# EAGLE design DRV8876_Breakout (EAGLE 9.4.2)
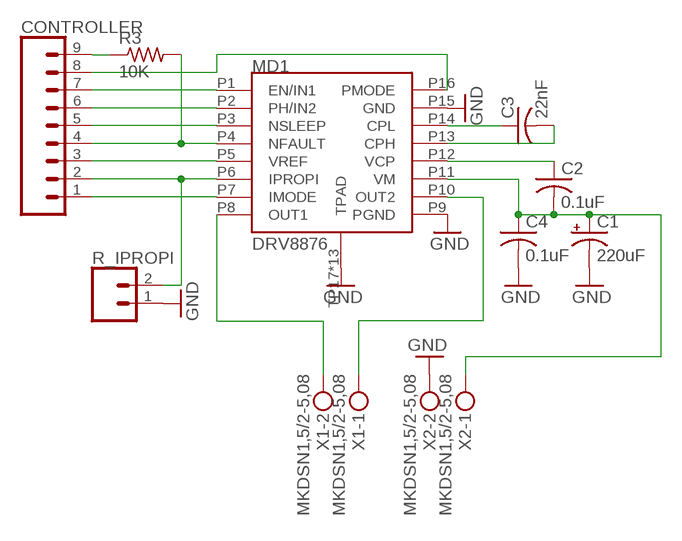
[diagram p0: schematic, sheet 1]

## Parts
C1  220uF  CPOL-USE3.5-8  [E3,5-8]
C2  0.1uF  C-USC0805  [C0805]
C3  22nF  C-USC0805  [C0805]
C4  0.1uF  C-USC0805  [C0805]
CONTROLLER  CONN_09NO_SILK  [1X09_NO_SILK]
MD1  DRV8876  [DRV8876]
R3  10K  R-US_R0805  [R0805]
R_IPROPI  CONN_021X02_NO_SILK  [1X02_NO_SILK]
X1  MKDSN1,5/2-5,08  [MKDSN1,5/2-5,08]
X2  MKDSN1,5/2-5,08  [MKDSN1,5/2-5,08]

## Nets
CLP: C3.1 MD1.P14(CPL)
CPH: C3.2 MD1.P13(CPH)
EN/IN1: CONTROLLER.7 MD1.P1(EN/IN1)
GND: C1.- C4.2 MD1.P9(PGND) MD1.P15(GND) MD1.TP17(TPAD) MD1.TV18(TPAD) MD1.TV19(TPAD) MD1.TV20(TPAD) MD1.TV21(TPAD) MD1.TV22(TPAD) MD1.TV23(TPAD) MD1.TV24(TPAD) MD1.TV25(TPAD) MD1.TV26(TPAD) MD1.TV27(TPAD) MD1.TV28(TPAD) MD1.TV29(TPAD) R_IPROPI.1 X2.2
IMODE: CONTROLLER.1 MD1.P7(IMODE)
IPROPI: CONTROLLER.2 MD1.P6(IPROPI) R_IPROPI.2
NFAULT: CONTROLLER.4 MD1.P4(NFAULT) R3.2
NSLEEP: CONTROLLER.5 MD1.P3(NSLEEP)
OUT1: MD1.P8(OUT1) X1.2
OUT2: MD1.P10(OUT2) X1.1
PH/IN2: CONTROLLER.6 MD1.P2(PH/IN2)
PMODE: CONTROLLER.8 MD1.P16(PMODE)
VCC: CONTROLLER.9 R3.1
VCP: C2.1 MD1.P12(VCP)
VM: C1.+ C2.2 C4.1 MD1.P11(VM) X2.1
VREF: CONTROLLER.3 MD1.P5(VREF)

## Library data of the parts
C1 = rcl:CPOL-US: POLARIZED CAPACITOR, American symbol; SPICEPREFIX: C
C2-C4 = rcl:C-US: CAPACITOR, American symbol; SPICEPREFIX: C
CONTROLLER = SparkFun-Connectors:CONN_09: Multi connection point. Often used as Generic Header-pin footprint for 0.1 inch spaced/style header connections On any of the 0.1 inch spaced packages, you can populate with these: Break Away Headers - Straight <https://www.sparkfun.com/products/116> (PRT-00116) Break Away Male Headers - Right Angle <https://www.sparkfun.com/products/553> (PRT-00553) Female Headers <https://www.sparkfun.com/products/115> (PRT-00115) Break Away Headers - Machine Pin <https://www.sparkfun.com/products/117> (PRT-00117) Break Away Female Headers - Swiss Machine Pin <https://www.sparkfun.com/products/743> (PRT-00743) For SCREWTERMINALS and SPRING TERMINALS visit here: Screw Terimnals on SparkFun.com <https://www.sparkfun.com/search/results?term=Screw+Terminals> (5mm/3.5mm/2.54mm spacing) This device is also useful as a general connection point to wire up your design to another part of your project. Our various solder wires solder well into these plated through hole pads. Hook-Up Wire - Assortment (Stranded, 22 AWG) <https://www.sparkfun.com/products/11375> (PRT-11375) Hook-Up Wire - Assortment (Solid Core, 22 AWG) <https://www.sparkfun.com/products/11367> (PRT-11367) View the entire wire category on our website here <https://www.sparkfun.com/categories/141> Special notes: Molex polarized connector foot print use with SKU : PRT-08231 with associated crimp pins and housings. 1MM SMD Version SKU: PRT-10208 NOTES ON THE VARIANTS LOCK and LOCK_LONGPADS... This footprint was designed to help hold the alignment of a through-hole component (i.e. 6-pin header) while soldering it into place. You may notice that each hole has been shifted either up or down by 0.005 of an inch from it's more standard position (which is a perfectly straight line). This slight alteration caused the pins (the squares in the middle) to touch the edges of the holes. Because they are alternating, it causes a "brace" to hold the component in place. 0.005 has proven to be the perfect amount of "off-center" position when using our standard breakaway headers. Although looks a little odd when you look at the bare footprint, once you have a header in there, the alteration is very hard to notice. Also,if you push a header all the way into place, it is covered up entirely on the bottom side.
MD1 = Palmer Robotics:DRV8876
R3 = rcl:R-US_: RESISTOR, American symbol; SPICEPREFIX: R
R_IPROPI = SparkFun-Connectors:CONN_02: Multi connection point. Often used as Generic Header-pin footprint for 0.1 inch spaced/style header connections On any of the 0.1 inch spaced packages, you can populate with these: Break Away Headers - Straight <https://www.sparkfun.com/products/116> (PRT-00116) Break Away Male Headers - Right Angle <https://www.sparkfun.com/products/553> (PRT-00553) Female Headers <https://www.sparkfun.com/products/115> (PRT-00115) Break Away Headers - Machine Pin <https://www.sparkfun.com/products/117> (PRT-00117) Break Away Female Headers - Swiss Machine Pin <https://www.sparkfun.com/products/743> (PRT-00743) For SCREWTERMINALS and SPRING TERMINALS visit here: Screw Terimnals on SparkFun.com <https://www.sparkfun.com/search/results?term=Screw+Terminals> (5mm/3.5mm/2.54mm spacing) This device is also useful as a general connection point to wire up your design to another part of your project. Our various solder wires solder well into these plated through hole pads. Hook-Up Wire - Assortment (Stranded, 22 AWG) <https://www.sparkfun.com/products/11375> (PRT-11375) Hook-Up Wire - Assortment (Solid Core, 22 AWG) <https://www.sparkfun.com/products/11367> (PRT-11367) View the entire wire category on our website here <https://www.sparkfun.com/categories/141> Special notes: Molex polarized connector foot print use with: PRT-08233 with associated crimp pins and housings. 2.54_SCREWTERM for use with PRT-10571. 3.5mm Screw Terminal footprints for PRT-08084 5mm Screw Terminal footprints for use with PRT-08432
X1 X2 = con-phoenix-508:MKDSN1,5/2-5,08: MKDSN 1,5/ 2-5,08 Printklemme Nennstrom: 13,5 A Nennspannung: 250 V Rastermaß: 5,08 mm Polzahl: 2 Anschlussart: Schraubanschluss Montage: Löten Anschlussrichtung Leiter/Platine: 0 ° Artikelnummer: 1729128 Source: http://eshop.phoenixcontact.com .. 1729128.pdf

## Board
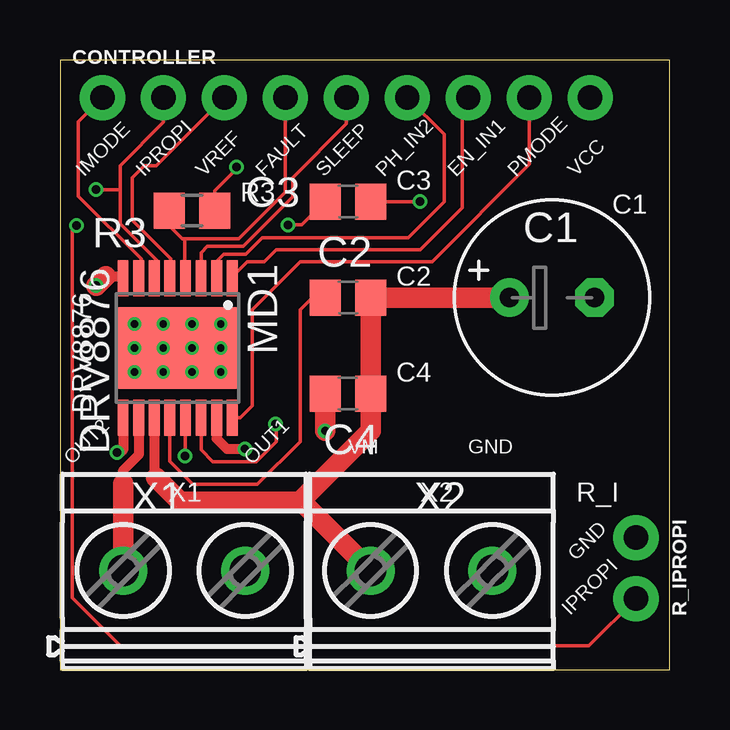
[diagram p1: board, top side]
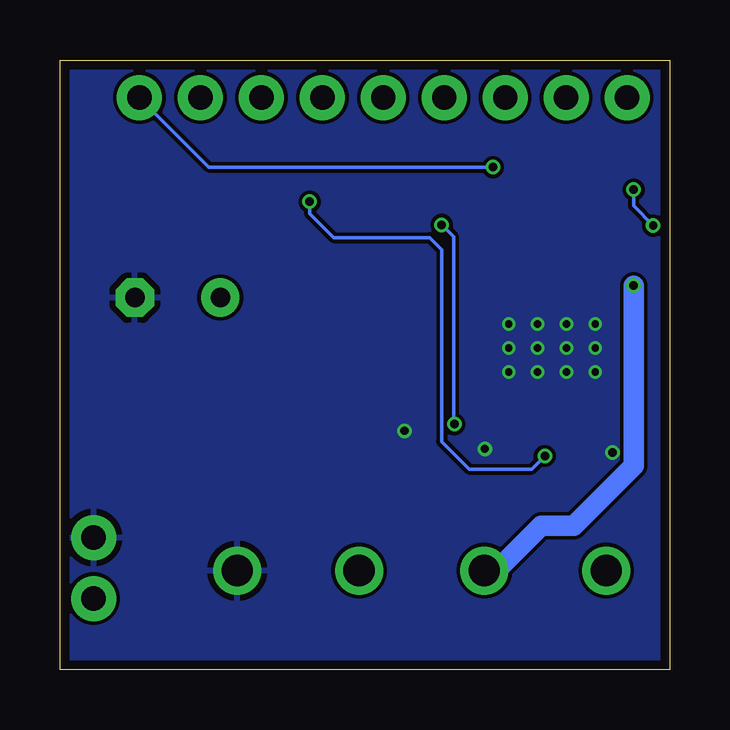
[diagram p2: board, bottom side, seen from below]

Size 25.4 x 25.4 mm. Coordinates in mm from the lower left corner, seen from the top.
Outline: 0,0 25.4,0 25.4,25.4 0,25.4 0,0
Copper layers (1*16): Top 0.035559375mm / dielectric 1.6mm / Bottom 0.035559375mm
Design rules "oshpark-2layer": minimum track width 6mil, minimum drill 10mil, track to track 6mil, track to pad 6mil, pad to pad 6mil, via to via 6mil, smd to smd 6mil, copper to edge 15mil, drill to drill 6mil, minimum pad ring 5mil, minimum via ring 5mil, stop-mask expansion 2.5mil, vias tented up to drill 0mil, thermal gap 10mil

### Footprints (pad centres in the part's own frame; a part is rotated, then mirrored left to right if it is on the bottom)
E3,5-8 = drill 0.813 pad 1.6: + -1.778,0 | drill 0.813 pad 1.6 octagon: - 1.778,0
C0805 = smd 1.3 x 1.5: 1 -0.95,0; 2 0.95,0
1X09_NO_SILK = drill 1.016 pad 1.88: 1 0,0; 2 2.54,0; 3 5.08,0; 4 7.62,0; 5 10.16,0; 6 12.7,0; 7 15.24,0; 8 17.78,0; 9 20.32,0
DRV8876 = smd 1.5 x 0.45: P1 -2.9,2.275; P2 -2.9,1.625; P3 -2.9,0.975; P4 -2.9,0.325; P5 -2.9,-0.325; P6 -2.9,-0.975; P7 -2.9,-1.625; P8 -2.9,-2.275; P9 2.9,-2.275; P10 2.9,-1.625; P11 2.9,-0.975; P12 2.9,-0.325; P13 2.9,0.325; P14 2.9,0.975; P15 2.9,1.625; P16 2.9,2.275 | smd 3.4 x 5: TP17 0,0 | drill 0.3 pad 0.5: TV18 -1,-1.8; TV19 0,-1.8; TV20 1,-1.8; TV21 -1,-0.6; TV22 0,-0.6; TV23 1,-0.6; TV24 -1,0.6; TV25 0,0.6; TV26 1,0.6; TV27 -1,1.8; TV28 0,1.8; TV29 1,1.8
R0805 = smd 1.3 x 1.5: 1 -0.95,0; 2 0.95,0
1X02_NO_SILK = drill 1.016 pad 1.88: 1 0,0; 2 2.54,0
MKDSN1,5/2-5,08 = drill 1.3 pad 2: 1 -2.561,0.025; 2 2.519,0.025

### Placement (x,y rotation side)
C1  20.5,15.5 0 top
C2  12,15.5 0 top
C3  12,19.5 0 top
C4  12,11.5 180 top
CONTROLLER  1.77,23.83 0 top
MD1  4.9,13.4 270 top
R3  5.5,19.12 180 top
R_IPROPI  24,5.5 270 top
X1  5.2,4.1 0 top
X2  15.5,4.1 0 top

### Tracks (layer width: path | path; a pad name or v marks a point on that pad's centre or on a via)
CLP  (via drill 0.35)
  Top 0.152: C3.1 10.08,18.53 v9.5,18.53 | MD1.P14 5.88,9.17 6.37,8.67 8.17,8.67 9,9.5 9,10.19 v8.97,10.22
  Bottom 0.152: v9.5,18.53 9,18.03 9,10.22 v8.97,10.22
CPH  (via drill 0.35)
  Top 0.152: v15,19.5 C3.2 | v5.2,8.9 5.22,8.93 MD1.P13
  Bottom 0.152: v15,19.5 15,19 14,18 10,18 9.5,17.5 9.5,9.5 8.35,8.35 5.75,8.35 v5.2,8.9
EN/IN1
  Top 0.152: CONTROLLER.7 16.75,23.57 16.75,19.25 15,17.5 9,17.5 8.5,17 7.8,17 7.17,16.38 MD1.P1
GND  (via drill 0.35)
  Top 0.406: v2.38,9.05 2.53,9.05 2.62,9.15 MD1.P9 | MD1.P15 6.53,9.62 6.95,9.2 v7.7,9.2
  Top 0.845: C4.2 v11.05,9.95
  pour Bottom: 0,25.4 25.4,25.4 25.4,0 0,0
IMODE
  Top 0.152: CONTROLLER.1 0.77,22.83 0.77,19.73 3.38,17.12 3.38,16.4 MD1.P7
IPROPI  (via drill 0.35)
  Top 0.152: 2.5,20 2.5,21 4.31,22.81 CONTROLLER.2 | 2.5,20 2.5,18.57 4.03,17.05 4.03,16.4 MD1.P6 | R_IPROPI.2 22.04,1 2.5,1 0.5,3 0.5,18.32 v0.68,18.5 | v1.5,20 2.5,20
  Bottom 0.152: v0.68,18.5 1.5,19.32 v1.5,20
NFAULT
  Top 0.152: R3.2 4.55,18.5 5.1,17.95 5.2,17.95 | CONTROLLER.4 9.39,19.89 7.45,17.95 5.2,17.95 | MD1.P4 5.2,16.32 5.2,17.95
NSLEEP
  Top 0.152: CONTROLLER.5 11.93,22.73 9.7,20.5 9.7,19.7 7.64,17.64 6.14,17.64 5.88,17.38 MD1.P3
OUT1  (via drill 0.35)
  Top 0.406: 1.9,16.4 2.52,16.4 MD1.P8
  Top 0.845: v1.5,16 1.9,16.4
  Bottom 0.845: X1.2 7.22,4.12 5.34,6 4,6 1.5,8.5 v1.5,16
OUT2
  Top 0.406: 2.64,7.74 2.64,8.31 3.27,8.95 MD1.P10
  Top 0.845: 2.64,7.74 X1.1
PH/IN2
  Top 0.152: CONTROLLER.6 16,22.3 16,19.5 14.5,18 8.43,18 7.75,17.32 6.82,17.32 6.53,17.02 MD1.P2
PMODE
  Top 0.152: CONTROLLER.8 19.55,21.05 15.5,17 10,17 8,15 8,11 7.5,10.5 MD1.P16
VCC  (via drill 0.35)
  Top 0.152: v7.36,20.94 7.36,20.86 6.45,19.95 R3.1
  Bottom 0.152: v7.36,20.94 19.2,20.94 CONTROLLER.9
VCP
  Top 0.152: MD1.P12 4.58,8.68 5.53,7.72 8.22,7.72 10,9.5 10,15 10.5,15.5 C2.1
VM
  Top 0.406: 4,8 4.03,8.03 3.92,8.12 MD1.P11
  Top 0.845: 10.03,7.03 12.95,9.95 C4.1 C2.2 C1.+ | 10.03,7.03 10,7 5,7 4,8 | X2.1 10.03,7.03
VREF
  Top 0.152: CONTROLLER.3 4.02,21 3.5,21 3,20.5 3,18.72 4.61,17.11 4.61,16.34 MD1.P5

### Text on the board
tPlace: IMODE | IPROPI | VREF | R3 | FAULT | SLEEP | PH_IN2 | C3 | EN_IN1 | PMODE | VCC | C1 | C2 | C4 | DRV8876 | VM | GND | OUT2 | OUT1 | X1 | X2 | R_I | GND | IPROPI
Measures: 10k | 22nF | 0.1uF | 0.1uF | 220uF
tDocu: use 2 oz/ft^2 thickness